# EAGLE design TMP_1_0 (EAGLE 8.3.2)
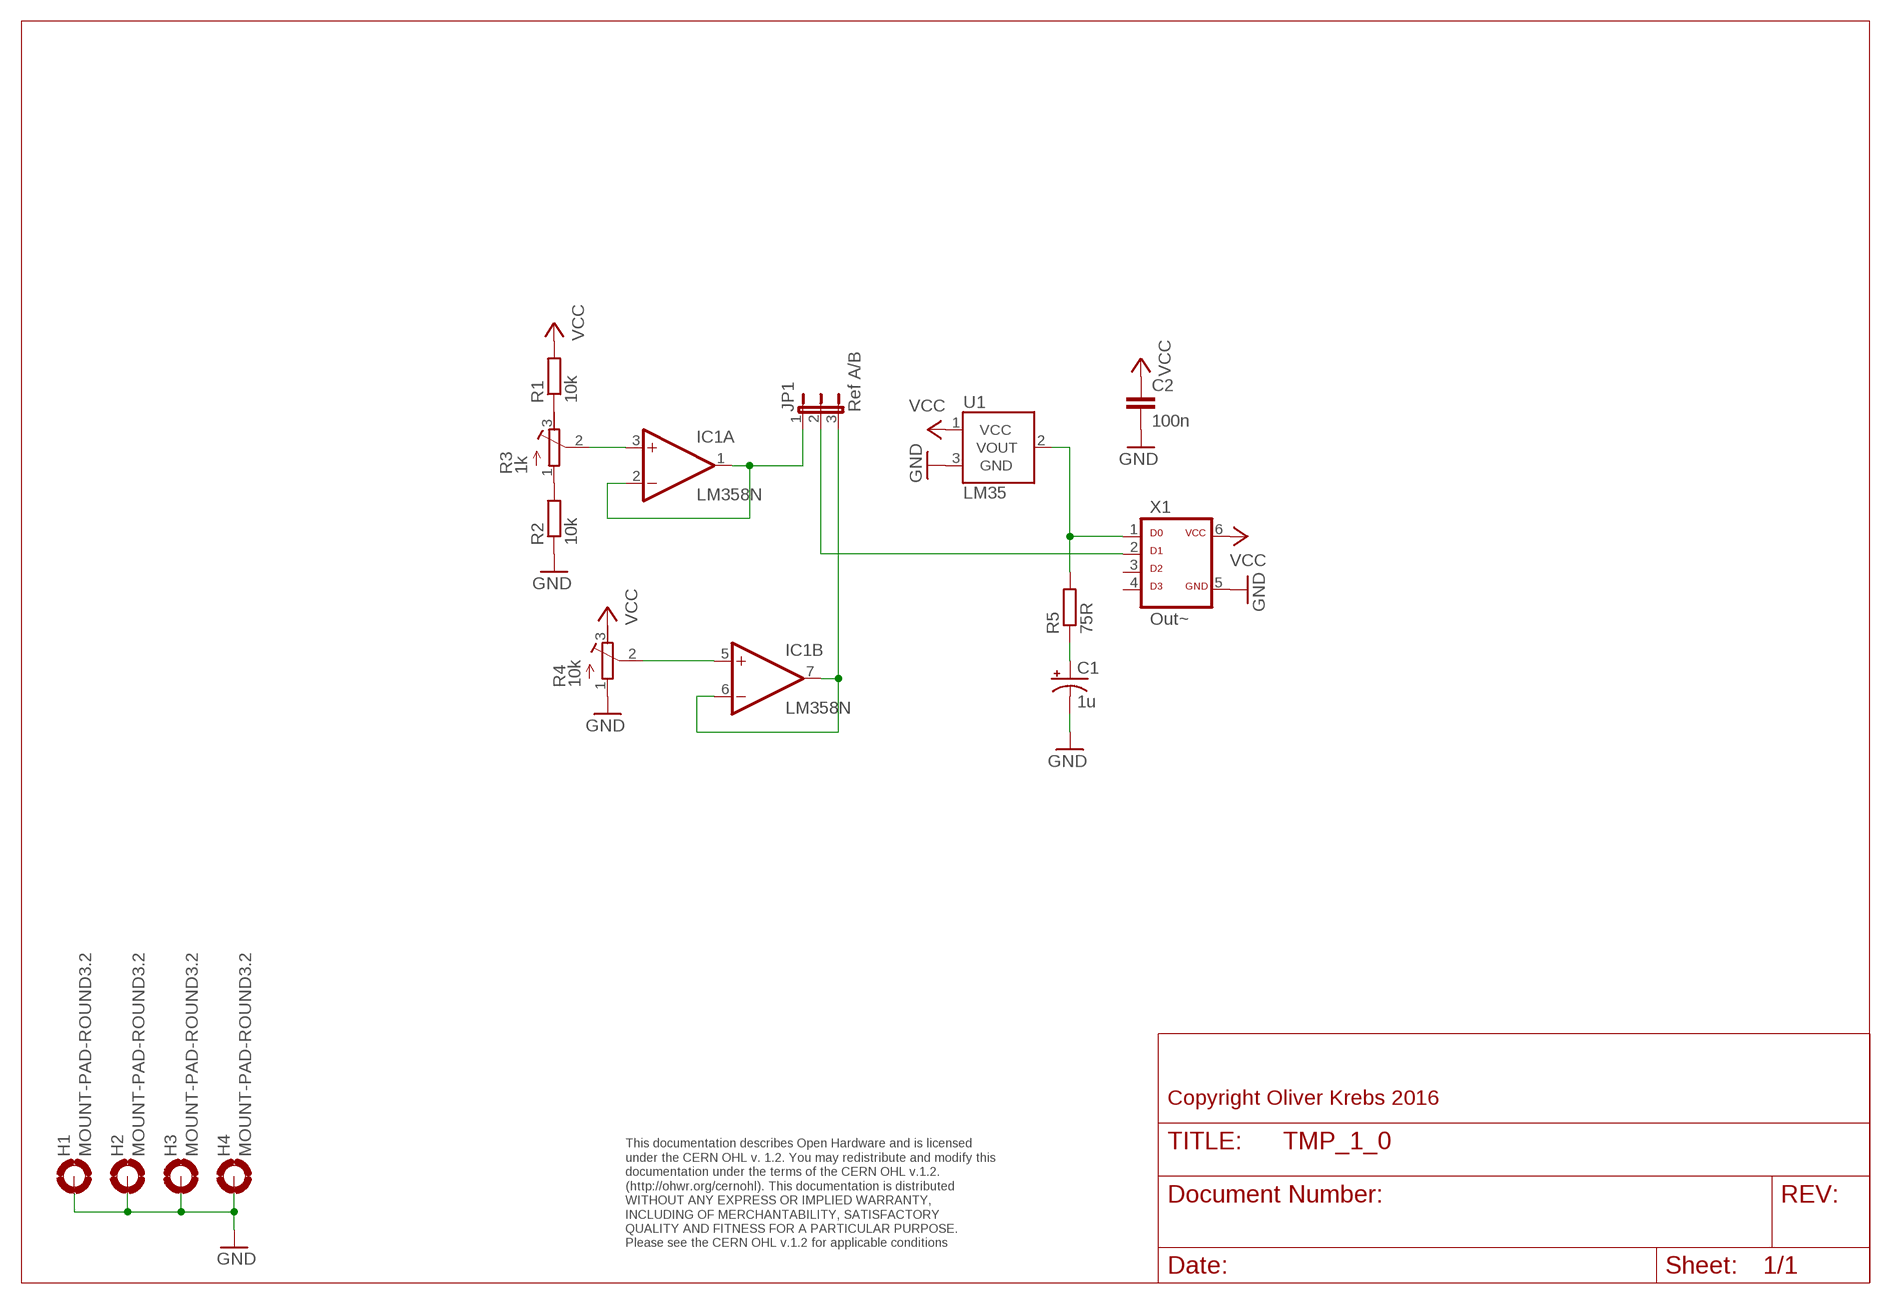
[diagram p0: schematic, sheet 1]

## Parts
C1  1u  CAP_POLPTH2  [CPOL-RADIAL-10UF-25V]
C2  100n  C-EU050-025X075  [C050-025X075]
H1  MOUNT-PAD-ROUND3.2  [3,2-PAD]
H2  MOUNT-PAD-ROUND3.2  [3,2-PAD]
H3  MOUNT-PAD-ROUND3.2  [3,2-PAD]
H4  MOUNT-PAD-ROUND3.2  [3,2-PAD]
IC1  LM358N  [DIL08]
JP1  Ref A/B  JP2EJP2-U  [JP2-U]
R1  10k  R-EU_0207/10  [0207/10]
R2  10k  R-EU_0207/10  [0207/10]
R3  1k  R-TRIMMACP  [ACP-6L]
R4  10k  R-TRIMMACP  [ACP-6L]
R5  75R  R-EU_0207/10  [0207/10]
U1  LM35  TMP36GT9  [TO-92]
X1  Out~  ML6D  [ML-6]

## Nets
GND: C1.2(-) C2.2 H1.B3,2(MOUNT) H2.B3,2(MOUNT) H3.B3,2(MOUNT) H4.B3,2(MOUNT) R2.1 R4.1(A) U1.3(GND) X1.5
N$1: R2.2 R3.1(A)
N$2: R1.1 R3.3(E)
N$3: IC1.3(A:+IN) R3.2(S)
N$4: IC1.1(A:OUT) IC1.2(A:-IN) JP1.1
N$5: JP1.2 X1.2
N$6: IC1.6(B:-IN) IC1.7(B:OUT) JP1.3
N$7: R5.2 U1.2(VOUT) X1.1
N$8: IC1.5(B:+IN) R4.2(S)
N$10: C1.1(+) R5.1
VCC: C2.1 R1.2 R4.3(E) U1.1(VCC) X1.6
Unconnected: X1.3 X1.4

## Notes on the sheet
- Copyright Oliver Krebs 2016
- This documentation describes Open Hardware and is licensed 
  under the CERN OHL v. 1.2. You may redistribute and modify this 
  documentation under the terms of the CERN OHL v.1.2. 
  (http://ohwr.org/cernohl). This documentation is distributed
  WITHOUT ANY EXPRESS OR IMPLIED WARRANTY, 
  INCLUDING OF MERCHANTABILITY, SATISFACTORY 
  QUALITY AND FITNESS FOR A PARTICULAR PURPOSE. 
  Please see the CERN OHL v.1.2 for applicable conditions

## Power pins joined to a net without a drawn wire
V+: IC1.8(P:V+)
V-: IC1.4(P:V-)

## Library data of the parts
C1 = SparkFun-Passives:CAP_POL: Capacitor Polarized These are standard SMD and PTH capacitors. Normally 10uF, 47uF, and 100uF in electrolytic and tantalum varieties. Always verify the external diameter of the through hole cap, it varies with capacity, voltage, and manufacturer. The EIA devices should be standard.
C2 = 01-my_rcl:C-EU: CAPACITOR, European symbol
H1-H4 = holes:MOUNT-PAD-ROUND: MOUNTING PAD, round
IC1 = 01-my-linear:LM358: OP AMP also LM158; LM258; LM2904 Source: http://cache.national.com/ds/LM/LM158.pdf
JP1 = 01-my-jumper:JP2E: JUMPER
R1 R2 R5 = 01-my_rcl:R-EU_: RESISTOR, European symbol
R3 R4 = 01-my_rcl:R-TRIMM: Trimm resistor
U1 = SparkFun-Sensors:TMP36: Precision degC temp sensor, analog out
X1 = 01-my-con:ML6D

## Board
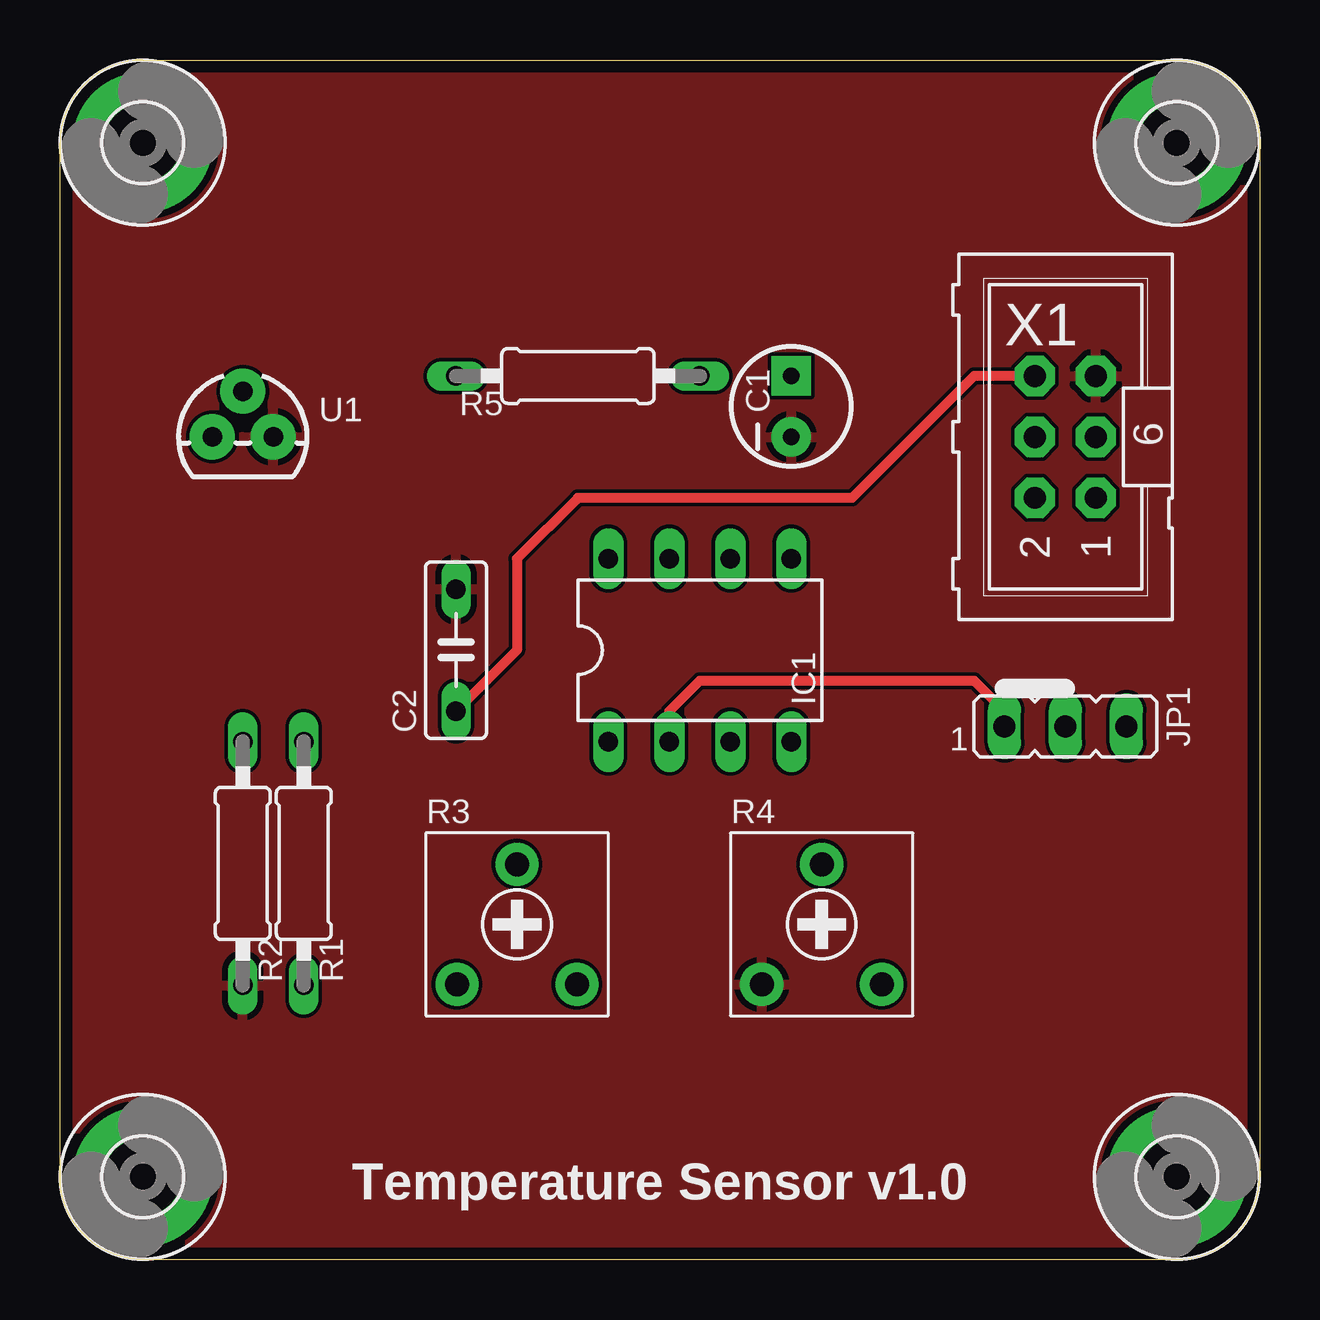
[diagram p1: board, top side]
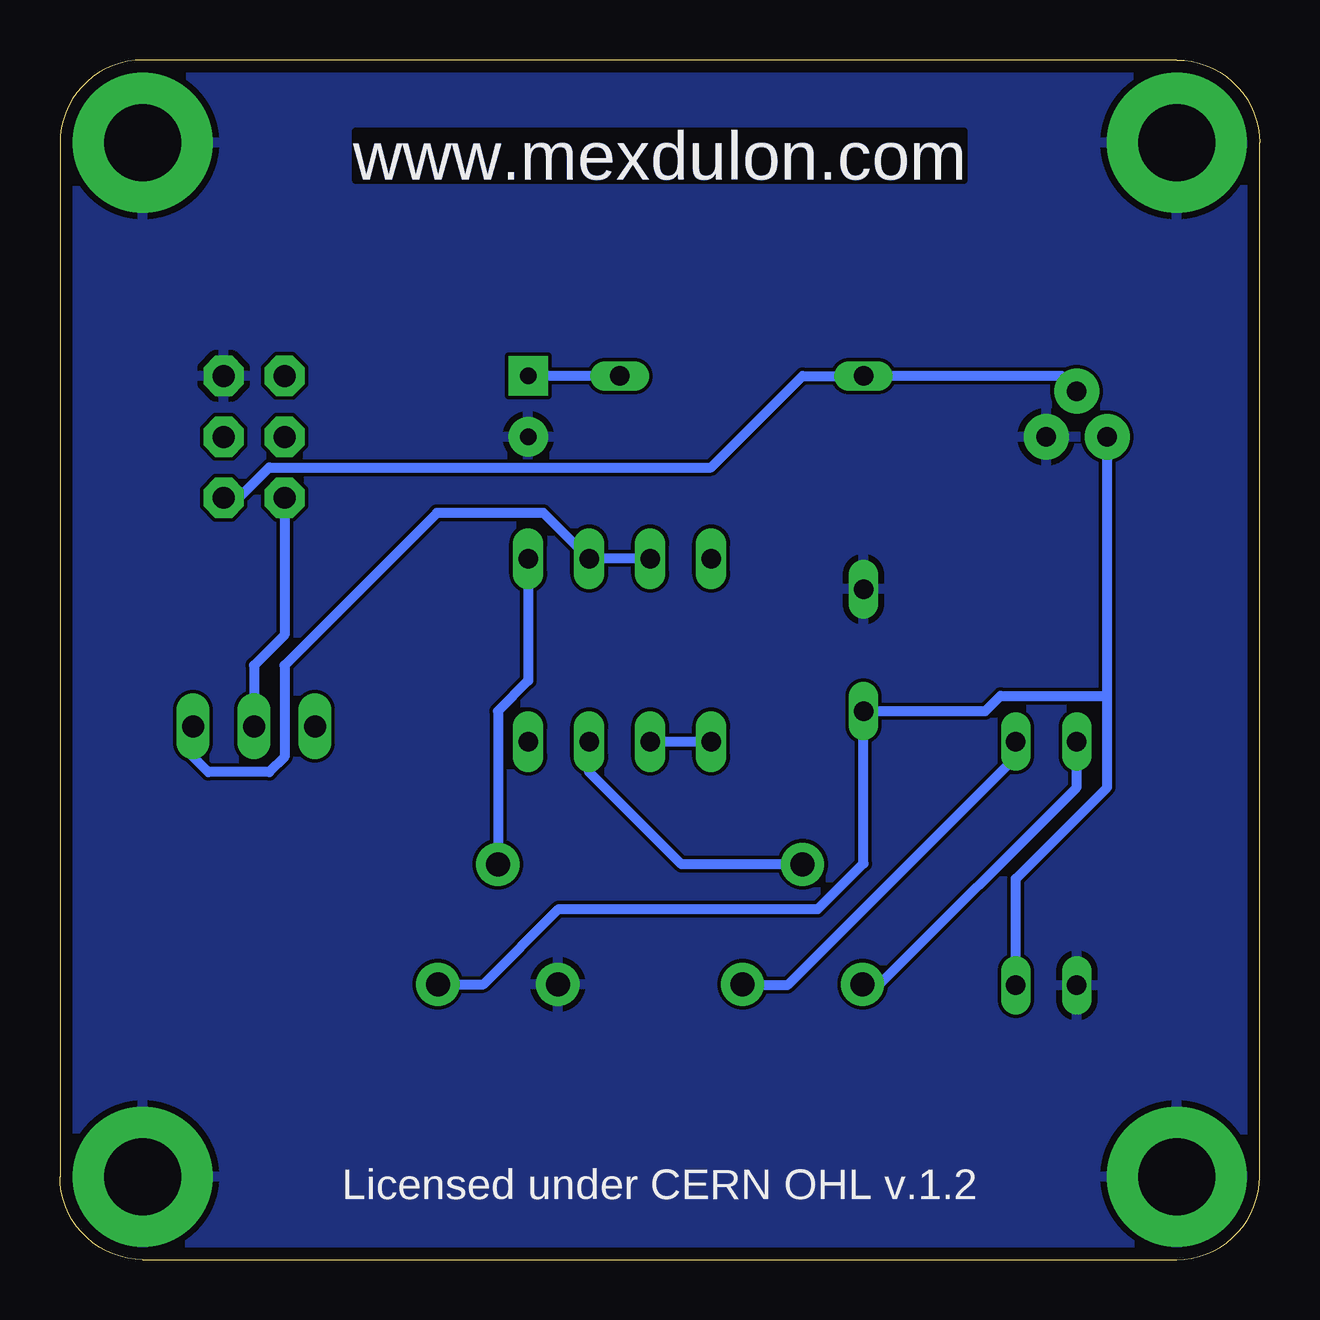
[diagram p2: board, bottom side, seen from below]

Size 50 x 50 mm. Coordinates in mm from the lower left corner, seen from the top.
Outline: 0,3.45 0,46.55 arc-90 3.45,50 46.55,50 arc-90 50,46.55 50,3.45 arc-90 46.55,0 3.45,0 arc-90 0,3.45
Copper layers (1*16): Top 0.035mm / dielectric 1.6mm / Bottom 0.035mm
Design rules "Elecrow_2-layer_PCB_eagle_rule": minimum track width 6mil, minimum drill 12mil, track to track 6mil, track to pad 6mil, pad to pad 6mil, via to via 8mil, smd to smd 0mil, copper to edge 20mil, drill to drill 10mil, minimum pad ring 6mil, minimum via ring 6mil, stop-mask expansion 0mil, vias tented up to drill 100mil, thermal gap 10mil

### Footprints (pad centres in the part's own frame; a part is rotated, then mirrored left to right if it is on the bottom)
CPOL-RADIAL-10UF-25V = drill 0.7 pad 1.651 square: 1 1.27,0 | drill 0.7 pad 1.651: 2 -1.27,0
C050-025X075 = drill 0.813 long: 1 -2.54,0; 2 2.54,0
3,2-PAD = drill 3.2 pad 5.842: B3,2 0,0
DIL08 = drill 0.813 pad 1.27 long: 1 -3.81,-3.81; 2 -1.27,-3.81; 3 1.27,-3.81; 4 3.81,-3.81; 5 3.81,3.81; 6 1.27,3.81; 7 -1.27,3.81; 8 -3.81,3.81
JP2-U = drill 0.914 long: 1 -2.54,0; 2 0,0; 3 2.54,0
0207/10 = drill 0.813 long: 1 -5.08,0; 2 5.08,0
ACP-6L = drill 1 pad 1.8: 1 -2.5,-2.5; 2 0,2.5; 3 2.5,-2.5
TO-92 = drill 0.813 pad 1.88: 1 -1.27,0; 2 0,1.905; 3 1.27,0
ML-6 = drill 0.914 pad 1.676 octagon: 1 -2.54,-1.27; 2 -2.54,1.27; 3 0,-1.27; 4 0,1.27; 5 2.54,-1.27; 6 2.54,1.27

### Placement (x,y rotation side)
C1  30.48,35.56 90 top
C2  16.51,25.4 90 top
H1  3.45,3.45 0 top
H2  3.45,46.55 0 top
H3  46.55,3.45 0 top
H4  46.55,46.55 0 top
IC1  26.67,25.4 0 top
JP1  41.91,22.23 0 top
R1  10.16,16.51 270 top
R2  7.62,16.51 90 top
R3  19.05,13.97 0 top
R4  31.75,13.97 0 top
R5  21.59,36.83 180 top
U1  7.62,34.29 0 top
X1  41.91,34.29 90 top

### Tracks (layer width: path | path; a pad name or v marks a point on that pad's centre or on a via)
GND
  pour Bottom: 0,0 50.8,0 50.8,50.8 0,50.8
  pour Top: 0,50.16 50.16,50.16 50.16,0 0,0
N$1
  Bottom 0.406: R3.1 15.84,11.47 7.62,19.68 R2.2
N$2
  Bottom 0.406: R1.1 10.16,20.95 19.68,11.43 21.51,11.43 R3.3
N$3
  Bottom 0.406: R3.2 24.09,16.47 27.94,20.32 IC1.3
N$4
  Top 0.406: IC1.2 25.4,22.86 26.67,24.13 38.1,24.13 39.37,22.86 JP1.1
  Bottom 0.406: IC1.2 IC1.1
N$5
  Bottom 0.406: X1.2 40.64,26.04 41.91,24.77 JP1.2
N$6
  Bottom 0.406: IC1.7 IC1.6 29.84,31.11 34.29,31.11 40.64,24.77 40.64,20.95 41.27,20.32 43.81,20.32 44.45,20.95 JP1.3
N$7
  Bottom 0.406: X1.1 42.55,31.75 41.27,33.02 22.86,33.02 19.05,36.83 R5.2 8.26,36.83 U1.2
N$8
  Bottom 0.406: IC1.5 30.48,24.13 31.75,22.86 R4.2
N$10
  Bottom 0.406: R5.1 C1.1
VCC
  Top 0.406: X1.6 38.1,36.83 33.02,31.75 21.59,31.75 19.05,29.21 19.05,25.4 C2.1
  Bottom 0.406: R4.3 32.34,11.47 29.21,14.61 18.41,14.61 16.51,16.51 C2.1 11.43,22.86 10.79,23.5 6.35,23.5 | R1.2 10.16,15.88 6.35,19.68 6.35,23.5 | 6.35,23.5 U1.1

### Text on the board
Bottom: www.mexdulon.com
tNames: Temperature Sensor v1.0
bNames: www.mexdulon.com | Licensed under CERN OHL v.1.2
tValues: Sensor | A: 2.4-2.6V | B: 0.0-5.0V